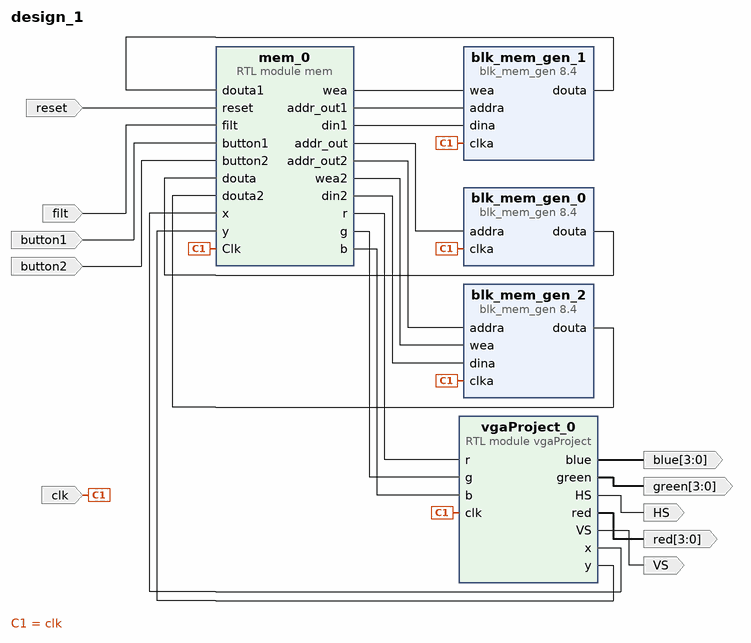
[diagram p0: block diagram of the top level]
# Vivado block design design_1, xc7z020clg484-1, Vivado 2018.2
create_bd_design design_1

create_bd_port -dir O -from 3 -to 0 red
create_bd_port -dir O HS
create_bd_port -dir O VS
create_bd_port -dir O -from 3 -to 0 green
create_bd_port -dir O -from 3 -to 0 blue
create_bd_port -dir I -type rst reset
create_bd_port -dir I -type clk clk
set_property -dict {CONFIG.FREQ_HZ 100000000 CONFIG.CLK_DOMAIN design_1_processing_system7_0_0_FCLK_CLK0} [get_bd_ports clk]
create_bd_port -dir I filt
create_bd_port -dir I button1
create_bd_port -dir I button2

create_bd_cell -type module -reference vgaProject vgaProject_0
create_bd_cell -type ip -vlnv xilinx.com:ip:blk_mem_gen:8.4 blk_mem_gen_0
set_property -dict [list \
  CONFIG.Enable_32bit_Address false \
  CONFIG.Use_Byte_Write_Enable false \
  CONFIG.Write_Width_A 8 \
  CONFIG.Write_Depth_A 10000 \
  CONFIG.Read_Width_A 8 \
  CONFIG.Operating_Mode_A READ_FIRST \
  CONFIG.Enable_A Always_Enabled \
  CONFIG.Register_PortA_Output_of_Memory_Primitives false \
  CONFIG.Load_Init_File true \
  CONFIG.Coe_File ../design_1_blk_mem_gen_0_0.coe \
  CONFIG.Fill_Remaining_Memory_Locations true \
  CONFIG.Remaining_Memory_Locations 00 \
  CONFIG.Use_RSTA_Pin false \
  CONFIG.use_bram_block Stand_Alone \
] [get_bd_cells blk_mem_gen_0]
create_bd_cell -type ip -vlnv xilinx.com:ip:blk_mem_gen:8.4 blk_mem_gen_1
set_property -dict [list \
  CONFIG.Enable_32bit_Address false \
  CONFIG.Use_Byte_Write_Enable false \
  CONFIG.Write_Width_A 8 \
  CONFIG.Write_Depth_A 10000 \
  CONFIG.Read_Width_A 8 \
  CONFIG.Enable_A Always_Enabled \
  CONFIG.Register_PortA_Output_of_Memory_Primitives true \
  CONFIG.Fill_Remaining_Memory_Locations true \
  CONFIG.Remaining_Memory_Locations 00 \
  CONFIG.Use_RSTA_Pin false \
  CONFIG.use_bram_block Stand_Alone \
] [get_bd_cells blk_mem_gen_1]
create_bd_cell -type ip -vlnv xilinx.com:ip:blk_mem_gen:8.4 blk_mem_gen_2
set_property -dict [list \
  CONFIG.Enable_32bit_Address false \
  CONFIG.Use_Byte_Write_Enable false \
  CONFIG.Write_Width_A 8 \
  CONFIG.Write_Depth_A 10000 \
  CONFIG.Read_Width_A 8 \
  CONFIG.Enable_A Always_Enabled \
  CONFIG.Register_PortA_Output_of_Memory_Primitives true \
  CONFIG.Fill_Remaining_Memory_Locations true \
  CONFIG.Remaining_Memory_Locations 00 \
  CONFIG.Use_RSTA_Pin false \
  CONFIG.use_bram_block Stand_Alone \
] [get_bd_cells blk_mem_gen_2]
create_bd_cell -type module -reference mem mem_0

# ---- connections ----

connect_bd_net [get_bd_pins vgaProject_0/red] [get_bd_ports red]
connect_bd_net [get_bd_pins vgaProject_0/HS] [get_bd_ports HS]
connect_bd_net [get_bd_pins vgaProject_0/VS] [get_bd_ports VS]
connect_bd_net [get_bd_pins vgaProject_0/green] [get_bd_ports green]
connect_bd_net [get_bd_pins vgaProject_0/blue] [get_bd_ports blue]
connect_bd_net [get_bd_pins vgaProject_0/x] [get_bd_pins mem_0/x]
connect_bd_net [get_bd_pins vgaProject_0/y] [get_bd_pins mem_0/y]
connect_bd_net [get_bd_pins mem_0/r] [get_bd_pins vgaProject_0/r]
connect_bd_net [get_bd_pins mem_0/g] [get_bd_pins vgaProject_0/g]
connect_bd_net [get_bd_pins mem_0/b] [get_bd_pins vgaProject_0/b]
connect_bd_net [get_bd_ports reset] [get_bd_pins mem_0/reset]
connect_bd_net [get_bd_ports clk] \
  [get_bd_pins vgaProject_0/clk] [get_bd_pins blk_mem_gen_0/clka] [get_bd_pins blk_mem_gen_1/clka] \
  [get_bd_pins blk_mem_gen_2/clka] [get_bd_pins mem_0/Clk]
connect_bd_net [get_bd_ports filt] [get_bd_pins mem_0/filt]
connect_bd_net [get_bd_pins blk_mem_gen_0/douta] [get_bd_pins mem_0/douta]
connect_bd_net [get_bd_pins mem_0/addr_out] [get_bd_pins blk_mem_gen_0/addra]
connect_bd_net [get_bd_pins mem_0/wea] [get_bd_pins blk_mem_gen_1/wea]
connect_bd_net [get_bd_pins mem_0/addr_out1] [get_bd_pins blk_mem_gen_1/addra]
connect_bd_net [get_bd_pins mem_0/din1] [get_bd_pins blk_mem_gen_1/dina]
connect_bd_net [get_bd_pins blk_mem_gen_1/douta] [get_bd_pins mem_0/douta1]
connect_bd_net [get_bd_pins mem_0/addr_out2] [get_bd_pins blk_mem_gen_2/addra]
connect_bd_net [get_bd_pins mem_0/wea2] [get_bd_pins blk_mem_gen_2/wea]
connect_bd_net [get_bd_pins blk_mem_gen_2/douta] [get_bd_pins mem_0/douta2]
connect_bd_net [get_bd_pins mem_0/din2] [get_bd_pins blk_mem_gen_2/dina]
connect_bd_net -net button1_1 [get_bd_ports button1] [get_bd_pins mem_0/button1]
connect_bd_net -net button2_1 [get_bd_ports button2] [get_bd_pins mem_0/button2]

validate_bd_design
save_bd_design
